# Altium schematic sheet LD_driver.SchDoc
size 420 x 297 mm; Address1: Address1; Address2: Address2; Address3: Address3; Address4: Address4; DocumentNumber: *Э3; SheetNumber: 5; SheetTotal: 11; DocumentType: Схема электрическая *
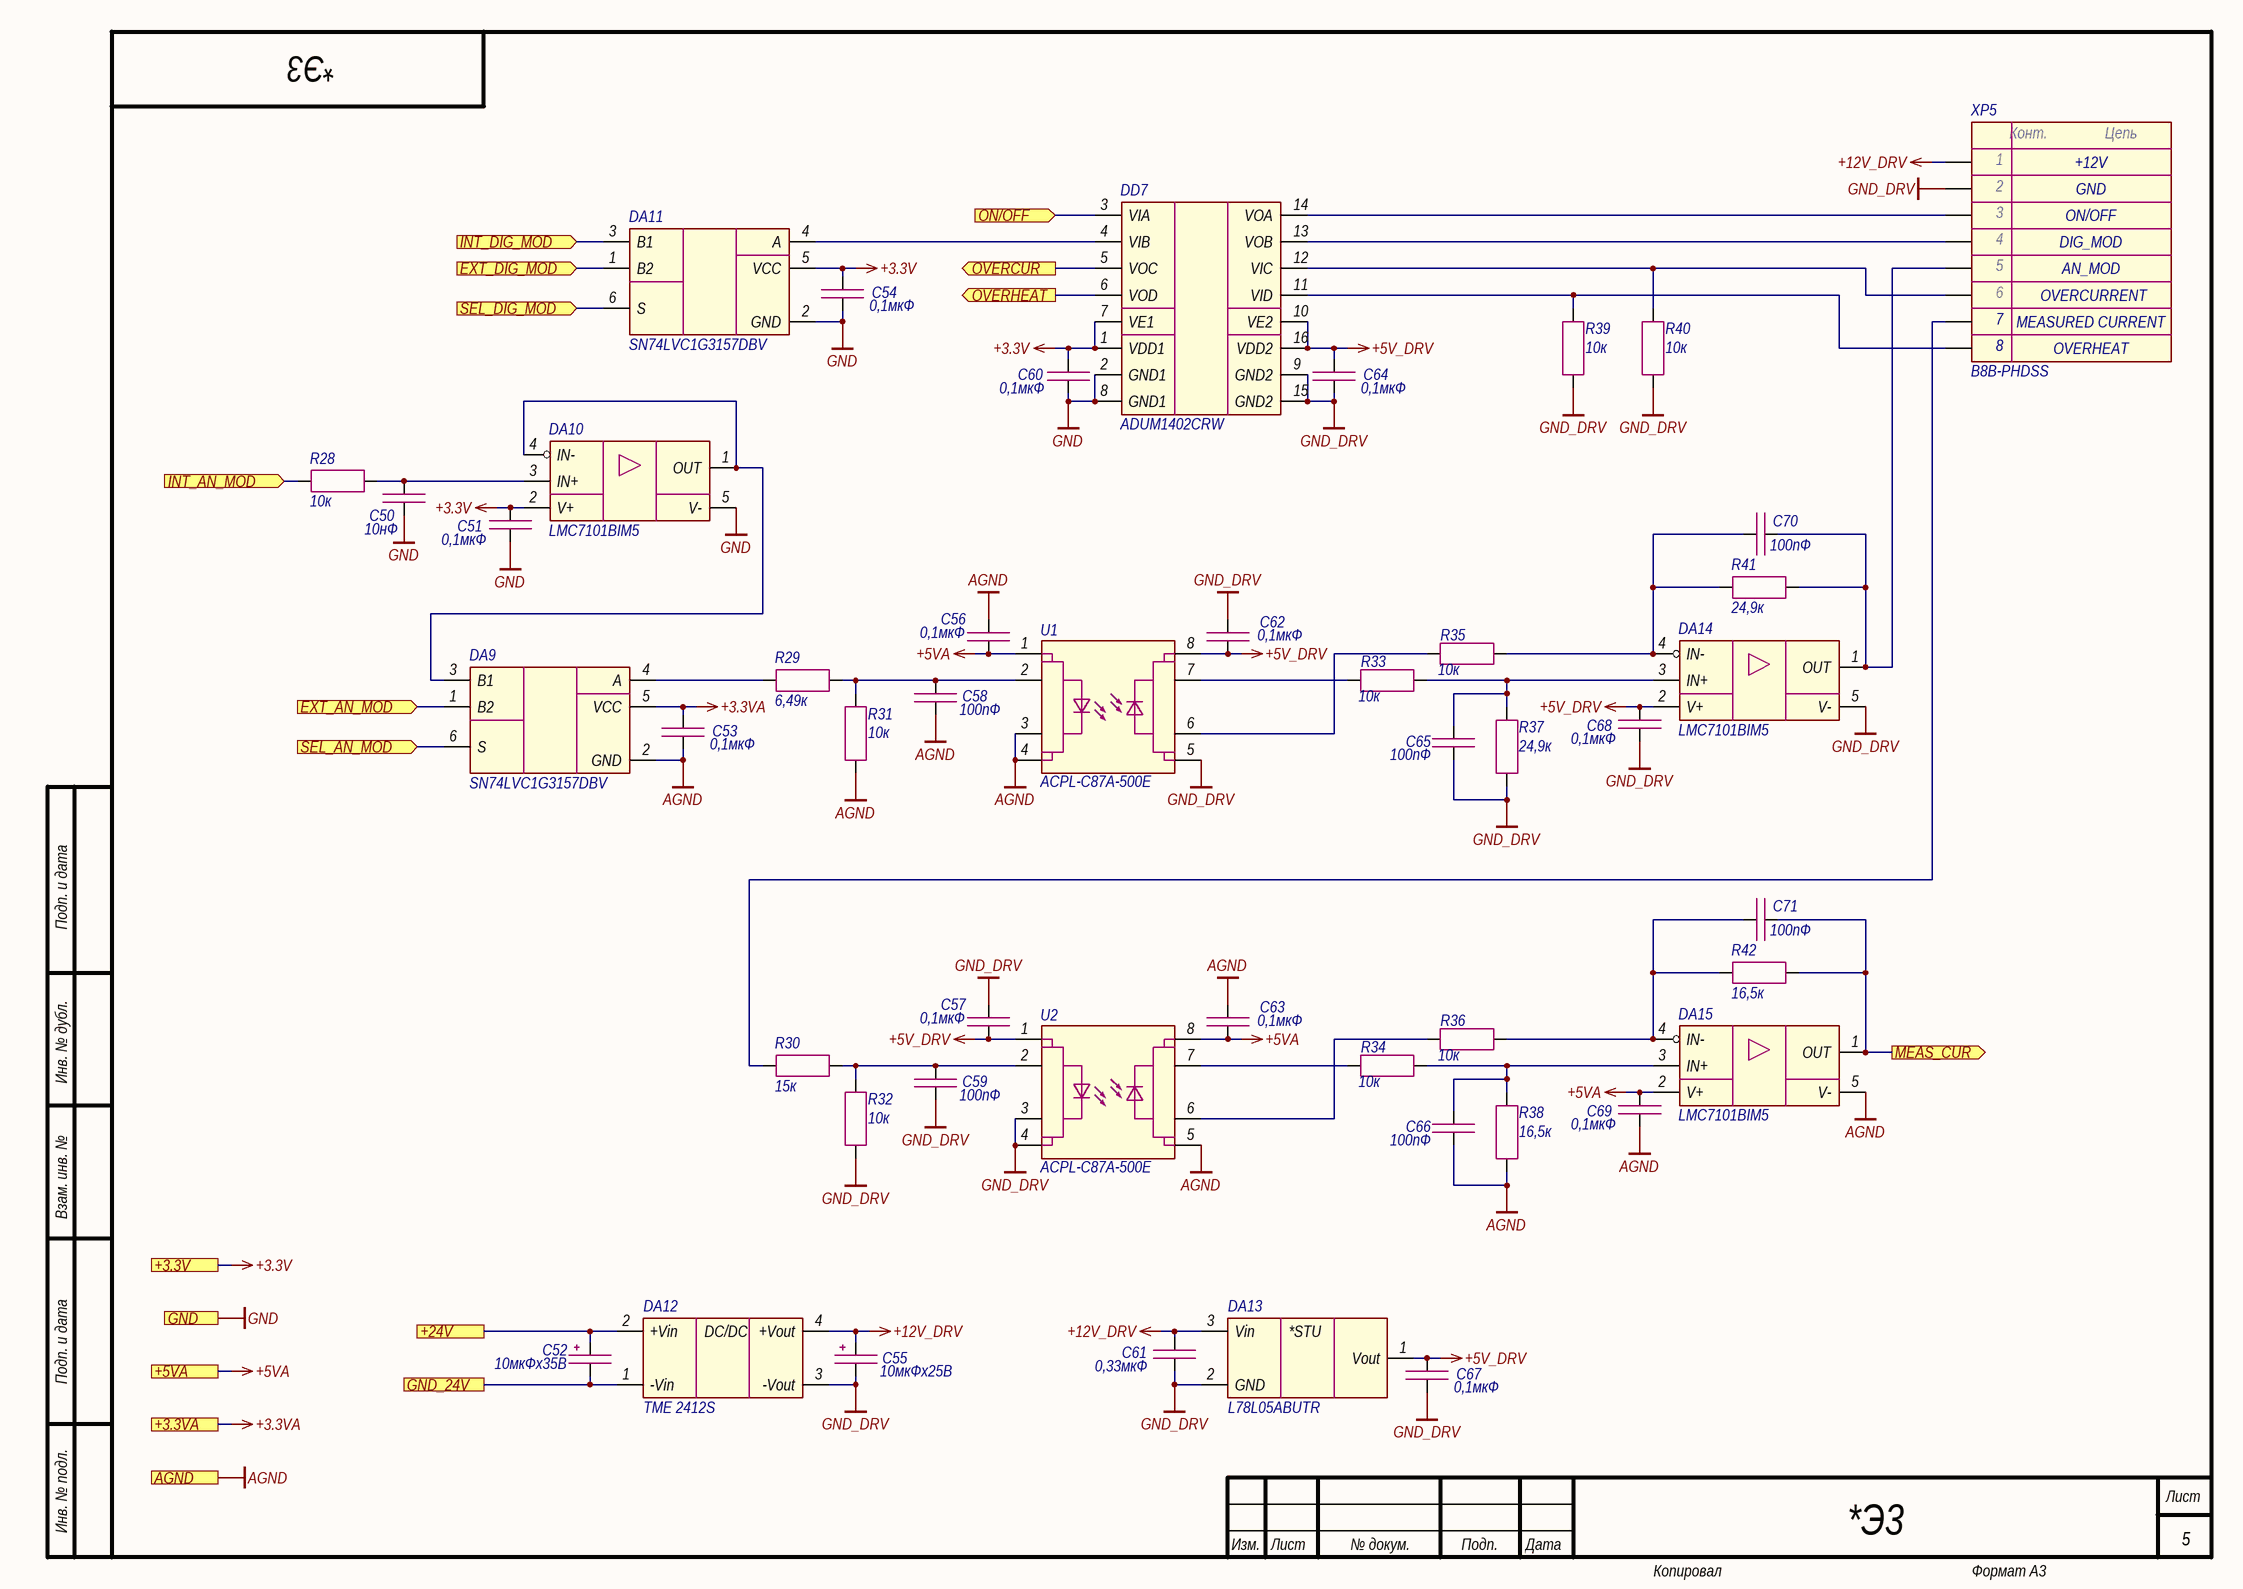
[diagram p0: LD_driver.SchDoc]

## Parts
C50  10нФ  [CAP_0603]
C51  0,1мкФ  [CAP_0603]
C52  10мкФх35B  [CAP_C]
C53  0,1мкФ  [CAP_0603]
C54  0,1мкФ  [CAP_0603]
C55  10мкФх25B  [CAP_C]
C56  0,1мкФ  [CAP_0603]
C57  0,1мкФ  [CAP_0603]
C58  100пФ  [CAP_0603]
C59  100пФ  [CAP_0603]
C60  0,1мкФ  [CAP_0603]
C61  0,33мкФ  [CAP_0805]
C62  0,1мкФ  [CAP_0603]
C63  0,1мкФ  [CAP_0603]
C64  0,1мкФ  [CAP_0603]
C65  100пФ  [CAP_0603]
C66  100пФ  [CAP_0603]
C67  0,1мкФ  [CAP_0603]
C68  0,1мкФ  [CAP_0603]
C69  0,1мкФ  [CAP_0603]
C70  100пФ  [CAP_0603]
C71  100пФ  [CAP_0603]
DA9  SN74LVC1G3157DBV  [SOT-23-6]
DA10  LMC7101BIM5  [SOT-23-5]
DA11  SN74LVC1G3157DBV  [SOT-23-6]
DA12  TME 2412S  [TME (SIP-4)]
DA13  L78L05ABUTR  [SOT-89]
DA14  LMC7101BIM5  [SOT-23-5]
DA15  LMC7101BIM5  [SOT-23-5]
DD7  ADUM1402CRW  [SOIC-16W]
R28  10к  [RES_0603]
R29  6,49к  [RES_0603]
R30  15к  [RES_0603]
R31  10к  [RES_0603]
R32  10к  [RES_0603]
R33  10к  [RES_0603]
R34  10к  [RES_0603]
R35  10к  [RES_0603]
R36  10к  [RES_0603]
R37  24,9к  [RES_0603]
R38  16,5к  [RES_0603]
R39  10к  [RES_0603]
R40  10к  [RES_0603]
R41  24,9к  [RES_0603]
R42  16,5к  [RES_0603]
U1  ACPL-C87A-500E  [SSO-8]
U2  ACPL-C87A-500E  [SSO-8]
XP5  B8B-PHDSS  [B8B-PHDSS]

## Ports
+3.3V (see Main[2C], Ethernet[3D], Fiber_interlock[2C], Flow_sensor[2C], Hardwiring[3D], Power_supply[1D]), +3.3VA (see Main[2C], Hardwiring[4D], Photodiode[1C], Thermistor[2C]), +5VA (see Main[2C], Hardwiring[3D], Photodiode[1C]), +24V (see Main[1C], Flow_sensor[2C], Hardwiring[3C], Indication[1C], Power_supply[1D]), AGND (see Main[2C], Hardwiring[4D], Photodiode[1D], Thermistor[2C]), EXT_AN_MOD (in, see Main[1C]), EXT_DIG_MOD (in, see Main[1C]), GND (see Main[2C], Ethernet[3D], Fiber_interlock[2C], Flow_sensor[2C], Guide_laser[1C], Hardwiring[3D], Indication[1C], Power_supply[1D]), GND_24V (see Main[1C], Flow_sensor[2C], Hardwiring[3C], Indication[1C], Power_supply[1D]), INT_AN_MOD (in, see Main[1C]), INT_DIG_MOD (in, see Main[1C]), MEAS_CUR (out, see Main[2C]), ON/OFF (in, see Main[1C]), OVERCUR (out, see Main[2C]), OVERHEAT (out, see Main[2C]), SEL_AN_MOD (in, see Main[1C]), SEL_DIG_MOD (in, see Main[1C])

## Nets
+3.3V: C51.1 C54.1 C60.1 DA10.2(V+) DA11.5(VCC) DD7.1(VDD1) DD7.7(VE1) ; port +3.3V
+3.3VA: C53.1 DA9.5(VCC) ; port +3.3VA
+5V_DRV: C57.1 C62.1 C64.1 C67.1 C68.1 DA13.1(Vout) DA14.2(V+) DD7.10(VE2) DD7.16(VDD2) U1.8(VDD2) U2.1(VDD1)
+5VA: C56.1 C63.1 C69.1 DA15.2(V+) U1.1(VDD1) U2.8(VDD2) ; port +5VA
+12V_DRV: C55.1 C61.2 DA12.4(+Vout) DA13.3(Vin) XP5.1
AGND: C53.2 C56.2 C58.1 C63.2 C66.2 C69.2 DA9.2(GND) DA15.5(V-) R31.2 R38.2 U1.3(SHDN) U1.4(GND1) U2.5(GND2) ; port AGND
GND: C50.2 C51.2 C54.2 C60.2 DA10.5(V-) DA11.2(GND) DD7.2(GND1) DD7.8(GND1) ; port GND
GND_DRV: C55.2 C57.2 C59.1 C61.1 C62.2 C64.2 C65.2 C67.2 C68.2 DA12.3(-Vout) DA13.2(GND) DA14.5(V-) DD7.9(GND2) DD7.15(GND2) R32.2 R37.1 R39.2 R40.2 U1.5(GND2) U2.3(SHDN) U2.4(GND1) XP5.2
+24V: C52.1 DA12.2(+Vin) ; port +24V
EXT_AN_MOD: DA9.1(B2) ; port EXT_AN_MOD
EXT_DIG_MOD: DA11.1(B2) ; port EXT_DIG_MOD
GND_24V: C52.2 DA12.1(-Vin) ; port GND_24V
INT_AN_MOD: R28.1 ; port INT_AN_MOD
INT_DIG_MOD: DA11.3(B1) ; port INT_DIG_MOD
MEAS_CUR: C71.2 DA15.1(OUT) R42.1 ; port MEAS_CUR
ON/OFF: DD7.3(VIA) ; port ON/OFF
OVERCUR: DD7.5(VOC) ; port OVERCUR
OVERHEAT: DD7.6(VOD) ; port OVERHEAT
SEL_AN_MOD: DA9.6(S) ; port SEL_AN_MOD
SEL_DIG_MOD: DA11.6(S) ; port SEL_DIG_MOD
NetC50_1: C50.1 DA10.3(IN+) R28.2
NetC58_2: C58.2 R29.1 R31.1 U1.2(VIN)
NetC59_2: C59.2 R30.1 R32.1 U2.2(VIN)
NetC65_1: C65.1 DA14.3(IN+) R33.2 R37.2
NetC66_1: C66.1 DA15.3(IN+) R34.2 R38.1
NetC70_1: C70.1 DA14.4(IN-) R35.2 R41.1
NetC70_2: C70.2 DA14.1(OUT) R41.2 XP5.5
NetC71_1: C71.1 DA15.4(IN-) R36.2 R42.2
NetDA9_3: DA9.3(B1) DA10.1(OUT) DA10.4(IN-)
NetDA9_4: DA9.4(A) R29.2
NetDA11_4: DA11.4(A) DD7.4(VIB)
NetDD7_11: DD7.11(VID) R39.1 XP5.8
NetDD7_12: DD7.12(VIC) R40.1 XP5.6
NetDD7_13: DD7.13(VOB) XP5.4
NetDD7_14: DD7.14(VOA) XP5.3
NetR30_2: R30.2 XP5.7
NetR33_1: R33.1 U1.7(VOUT+)
NetR34_1: R34.1 U2.7(VOUT+)
NetR35_1: R35.1 U1.6(VOUT-)
NetR36_1: R36.1 U2.6(VOUT-)

## Notes on the sheet
- +12V
- GND
- ON/OFF
- DIG_MOD
- (near XP5) MEASURED CURRENT
- AN_MOD
- OVERCURRENT
- OVERHEAT
- Подп. и дата
- Инв. № дубл.
- Взам. инв. №
- Инв. № подл.
- Изм.
- Лист
- № докум.
- Подп.
- Дата
- Копировал
- Формат А3
- (in symbol Connector-8) Конт.; Цепь
- (in symbol LD2981ABU50TR) *STU
- (in symbol TME) DC/DC

## Library data of the parts
C50 = Capacitor: Manufacturer: Murata; Model: GRM188R71H103JA01D; Value: 10нФ; Document: *
C51 C53 C54 C56 C57 C60 C62-C64 C67-C69 = Capacitor: Manufacturer: Murata; Model: GRM188R71H104KA93D; Value: 0,1мкФ; Document: *
C52 = Capacitor_Polar: Model: TECAP, 10 мкФ, 35 В, тип C, 10%; Value: 10мкФх35B; Document: *; Manufacturer: *
C55 = Capacitor_Polar: Model: TECAP, 10 мкФ, 25 В, тип B, 10%; Value: 10мкФх25B; Document: *; Manufacturer: *
C58 C59 C65 C66 C70 C71 = Capacitor: Manufacturer: Murata; Model: GRM1885C1H101JA01D; Value: 100пФ; Document: *
C61 = Capacitor: Manufacturer: Murata; Model: GRM219R71H334KA88D; Value: 0,33мкФ; Document: *
DA9 DA11 = SN74LVC1G3157: Manufacturer: Texas Instruments; Model: SN74LVC1G3157DBV; Document: *
DA10 DA14 DA15 = LMC7101: Manufacturer: Texas Instruments; Model: LMC7101BIM5; Document: *
DA12 = TME: Manufacturer: Traco Power; Model: TME 2412S; Document: *
DA13 = LD2981ABU50TR: Manufacturer: STMicroelectronics; Model: L78L05ABUTR; Document: *
DD7 = ADUM1402: Manufacturer: Analog Devices; Model: ADUM1402CRW; Document: *
R28 R31-R36 R39 R40 = Resistor: Manufacturer: Yageo; Model: RC0603FR-0710KL; Value: 10к; Document: *
R29 = Resistor: Manufacturer: Yageo; Model: RC0603FR-076K49L; Value: 6,49к; Document: *
R30 = Resistor: Manufacturer: Yageo; Model: RC0603FR-0715KL; Value: 15к; Document: *
R37 R41 = Resistor: Manufacturer: Yageo; Model: RC0603FR-0724K9L; Value: 24,9к; Document: *
R38 R42 = Resistor: Manufacturer: Yageo; Model: RC0603FR-0716K5L; Value: 16,5к; Document: *
U1 U2 = ACPL-C87: Manufacturer: Broadcom; Model: ACPL-C87A-500E
XP5 = Connector-8: Manufacturer: JST; Model: B8B-PHDSS; Document: *